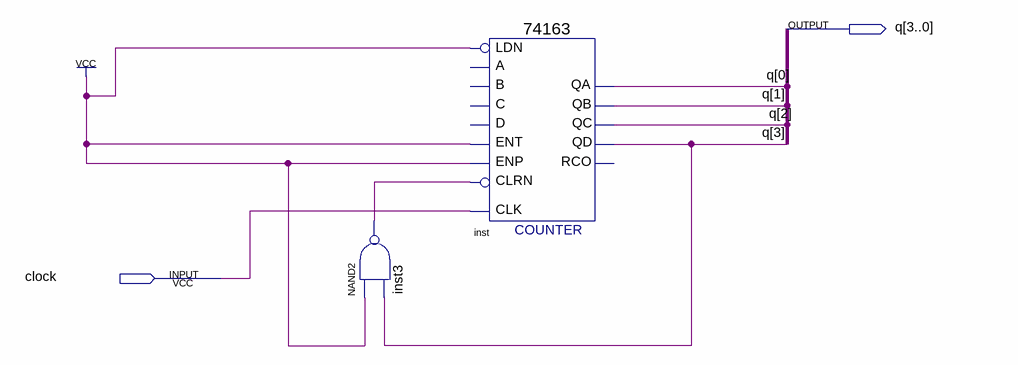
[diagram p0: schematic sheet]
// Quartus schematic SpecialCount.bdf as structural Verilog: 2 symbols, 2 pins
module SpecialCount (
  input  clock,
  output [3:0] q
);

  wire inst3_out;

  nand inst3 (inst3_out, 1'b1, q[3]);
  \74163  inst (
    .ENT(1'b1), .CLRN(inst3_out), .CLK(clock), .ENP(1'b1), .LDN(1'b1), .QA(q[0]), .QB(q[1]), .QC(q[2]),
    .QD(q[3]));  // open: C, B, A, D, RCO
endmodule
